# Altium schematic sheet SoftCore_SA_P2_PG7.SchDoc: =ProjectTitle
size B; Engineer: Hab S Collector; Address1: 3621 Gin Way; Address2: Snellville GA, 30039; SheetNumber: 7; SheetTotal: 7
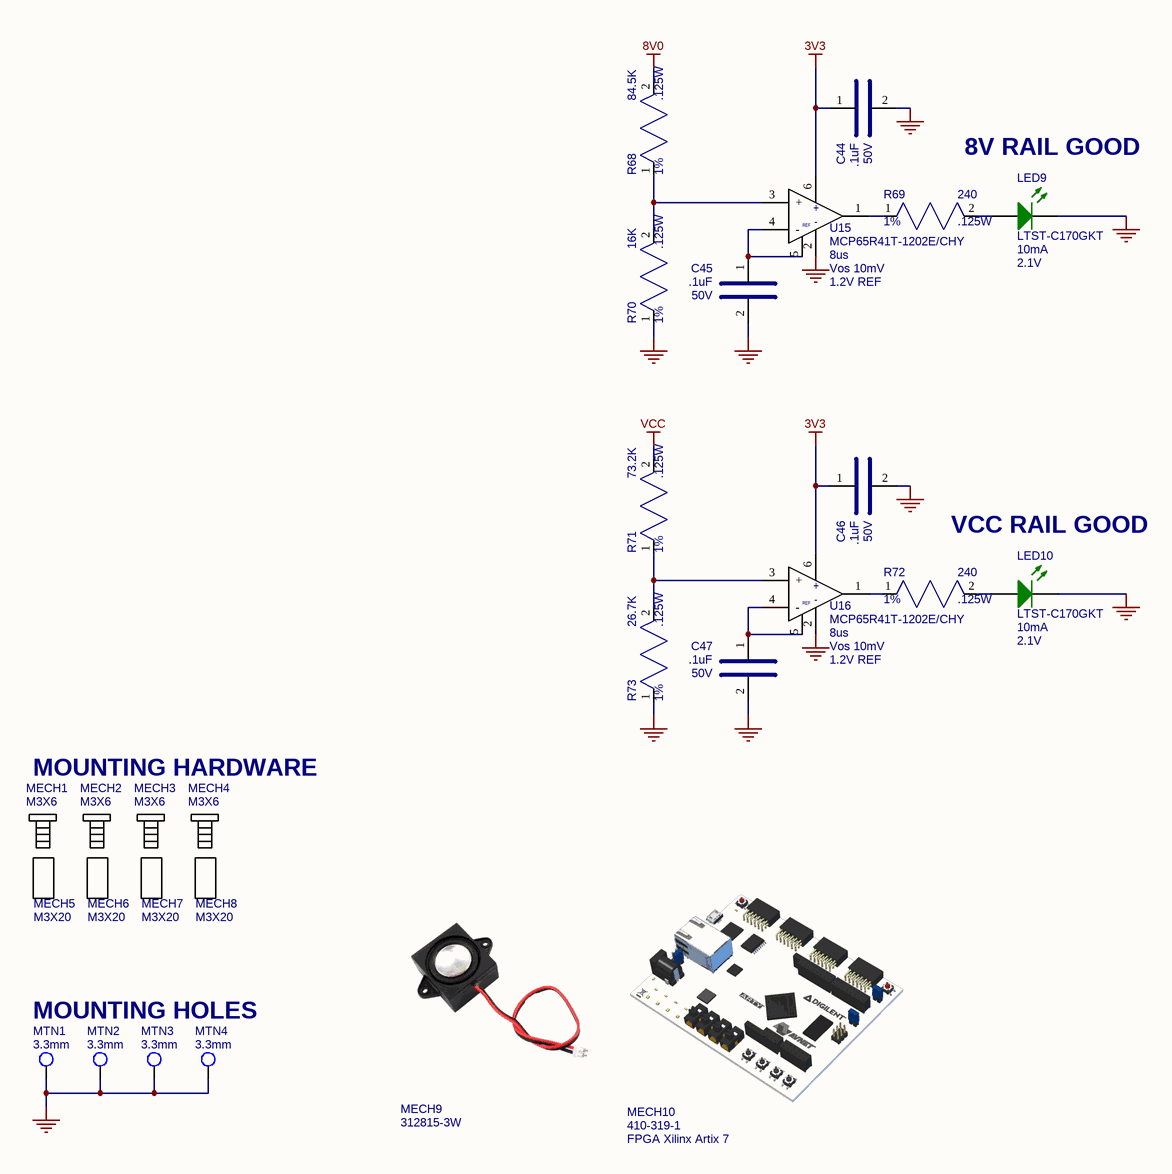
[diagram p0: SoftCore_SA_P2_PG7.SchDoc]

## Parts
C44  value .1uF  Voltage: 50V  [CAP_0805]  (hidden comment: KGM21NR71H104KT)
C45  value .1uF  Voltage: 50V  [CAP_0805]  (hidden comment: KGM21NR71H104KT)
C46  value .1uF  Voltage: 50V  [CAP_0805]  (hidden comment: KGM21NR71H104KT)
C47  value .1uF  Voltage: 50V  [CAP_0805]  (hidden comment: KGM21NR71H104KT)
LED9  value 2.1V  Current: 10mA  [LED_0805]  (hidden comment: LTST-C170GKT)
LED10  value 2.1V  Current: 10mA  [LED_0805]  (hidden comment: LTST-C170GKT)
MECH1  Size: M3X6  [MECHANICAL_SCREW_M3X6]  (hidden comment: RM3X6MM 2701)
MECH2  Size: M3X6  [MECHANICAL_SCREW_M3X6]  (hidden comment: RM3X6MM 2701)
MECH3  Size: M3X6  [MECHANICAL_SCREW_M3X6]  (hidden comment: RM3X6MM 2701)
MECH4  Size: M3X6  [MECHANICAL_SCREW_M3X6]  (hidden comment: RM3X6MM 2701)
MECH5  Size: M3X20  [MECHANICAL_SPACER_F_F_M3X20]  (hidden comment: 24407)
MECH6  Size: M3X20  [MECHANICAL_SPACER_F_F_M3X20]  (hidden comment: 24407)
MECH7  Size: M3X20  [MECHANICAL_SPACER_F_F_M3X20]  (hidden comment: 24407)
MECH8  Size: M3X20  [MECHANICAL_SPACER_F_F_M3X20]  (hidden comment: 24407)
MECH9  312815-3W  [312815-3W_PCB]
MECH10  value FPGA Xilinx Artix 7  [ARTY_A7_DEV_BOARD]  (hidden comment: 410-319-1)
MTN1  Hole Size: 3.3mm  [PMG_MT_HOLE_3.3MM]  (no BOM)
MTN2  Hole Size: 3.3mm  [PMG_MT_HOLE_3.3MM]  (no BOM)
MTN3  Hole Size: 3.3mm  [PMG_MT_HOLE_3.3MM]  (no BOM)
MTN4  Hole Size: 3.3mm  [PMG_MT_HOLE_3.3MM]  (no BOM)
R68  value 84.5K  Power: .125W  Tolerance: 1%  [RES_0805]  (hidden comment: RC0805FR-0784K5L)
R69  value 240  Power: .125W  Tolerance: 1%  [RES_0805]  (hidden comment: RC0805FR-13240RL)
R70  value 16K  Power: .125W  Tolerance: 1%  [RES_0805]  (hidden comment: RC0805FR-0716KL)
R71  value 73.2K  Power: .125W  Tolerance: 1%  [RES_0805]  (hidden comment: RC0805FR-0773K2L)
R72  value 240  Power: .125W  Tolerance: 1%  [RES_0805]  (hidden comment: RC0805FR-13240RL)
R73  value 26.7K  Power: .125W  Tolerance: 1%  [RES_0805]  (hidden comment: RC0805FR-0726K7L)
U15  Voltage Reference: 1.2V REF  Propagation Delay: 8us  Vos: Vos 10mV  [SOT-23-6_MC_MCH]  (hidden comment: MCP65R41T-1202E/CHY)
U16  Voltage Reference: 1.2V REF  Propagation Delay: 8us  Vos: Vos 10mV  [SOT-23-6_MC_MCH]  (hidden comment: MCP65R41T-1202E/CHY)

## Nets
3V3: C44.1 C46.1 U15.6 U16.6
8V0: R68.2
GND: C44.2 C45.2 C46.2 C47.2 LED9.K LED10.K MTN1.1 MTN2.1 MTN3.1 MTN4.1 R70.1 R73.1 U15.2 U16.2
VCC: R71.2
NetC45_1: C45.1 U15.4(-) U15.5
NetC47_1: C47.1 U16.4(-) U16.5
NetLED9_A: LED9.A R69.2
NetLED10_A: LED10.A R72.2
NetR68_1: R68.1 R70.2 U15.3(+)
NetR69_1: R69.1 U15.1
NetR71_1: R71.1 R73.2 U16.3(+)
NetR72_1: R72.1 U16.1

## Notes on the sheet
- 8V RAIL GOOD
- VCC RAIL GOOD
- MOUNTING HARDWARE
- MOUNTING HOLES
- Title
- Size:
- Date:
- B
- Number:
- Time:
- Revision:
- Sheet
- of
- IMR Engineering
- Engineer:
- File:
- (in symbol IC_COMPARATOR_MCP65R41T-1202E/CHY) REF

## Library data of the parts
C44-C47 = CAP_SMD_0.1UF_50V_0805: CAP CER 0.1UF 50V X7R 0805; MFG: KYOCERA AVX; Case/Package: 0805; MFG_PN: KGM21NR71H104KT; Supplier 1: DigiKey; Supplier Part Number 1: 478-KGM21NR71H104KTCT-ND; Unit Price: .1
LED9 LED10 = LED_GREEN_LTST-C170GKT: LED GREEN CLEAR SMD; MFG: Lite-On; Case/Package: 0805; Supplier 1: DigiKey; Supplier Part Number 1: 160-1179-1-ND; Unit Price: .10; MFG_PN: LTST-C170GKT
MECH1-MECH4 = MECHANICAL_SCREW_M3X6_PAN_HEAD: SCREW M3X6 PAN HEAD SS; MFG: APM Hexseal; Case/Package: SCREW_M3X6; Supplier 1: DigiKey; Supplier Part Number 1: 335-1156-ND; Unit Price: .58; MFG_PN: RM3X6MM 2701
MECH5-MECH8 = MECHANICAL_STANDOFF_M3X20: HEX STANDOFF M3 BRASS 20MM; MFG: Keystone Electronics; Case/Package: STANDOFF_M3X20; Supplier 1: DigiKey; Supplier Part Number 1: 36-24407-ND; Unit Price: 1.36; MFG_PN: 24407
MECH9 = MECHANICAL_SPEAKER_MOUNTED: SPEAKER PANEL MOUNT; MFG: ARDUINO; Case/Package: 312815-3W_PCB; Supplier 1: ARDUINO; Supplier Part Number 1: 312815-3W; Unit Price: 2.50; MFG_PN: 312815-3W
MECH10 = MODULE_ARTY_A7: DEVELOPMENT BOARD FPGA XILINX A7; MFG: Digilent, Inc.; Case/Package: NA; Supplier 1: DigiKey; Supplier Part Number 1: 1286-1206-ND; Unit Price: 299.00; MFG_PN: 410-319-1
MTN1-MTN4 = MTN_HOLE_3.3MM: MOUNTING HOLE 3.3MM
R68 = RES_SMD_84.5K_0805_1/8W_1%: RES SMD 84.5K OHM 1% 1/8W 0805; MFG: Yageo; Case/Package: 0805; MFG_PN: RC0805FR-0784K5L; Supplier 1: DigiKey; Supplier Part Number 1: 311-84.5KCRCT-ND; Unit Price: .1
R69 R72 = RES_SMD_240_0805_1/8W_1%: RES SMD 240 OHM 1% 1/8W 0805; MFG: Yageo; Case/Package: 0805; MFG_PN: RC0805FR-13240RL; Supplier 1: DigiKey; Supplier Part Number 1: 13-RC0805FR-13240RLCT-ND; Unit Price: .1
R70 = RES_SMD_16K_0805_1/8W_1%: RES SMD 16K OHM 1% 1/8W 0805; MFG: Yageo; Case/Package: 0805; MFG_PN: RC0805FR-0716KL; Supplier 1: DigiKey; Supplier Part Number 1: 311-16.0KCRCT-ND; Unit Price: .1
R71 = RES_SMD_73.2K_0805_1/8W_1%: RES SMD 73.2K OHM 1% 1/8W 0805; MFG: Yageo; Case/Package: 0805; MFG_PN: RC0805FR-0773K2L; Supplier 1: DigiKey; Supplier Part Number 1: 311-73.2KCRCT-ND; Unit Price: .1
R73 = RES_SMD_26.7K_0805_1/8W_1%: RES SMD 26.7K OHM 1% 1/8W 0805; MFG: Yageo; Case/Package: 0805; MFG_PN: RC0805FR-0726K7L; Supplier 1: DigiKey; Supplier Part Number 1: 311-26.7KCRCT-ND; Unit Price: .1
U15 U16 = IC_COMPARATOR_MCP65R41T-1202E/CHY: IC COMPARATOR 1 W/VOLT REF SOT23; MFG: Microchip Technology; Unit Price: .53; Package/Case: SOT-23-6; Supplier 1: DigiKey; Supplier Part Number 1: MCP65R41T-1202E/CHYCT-ND; MFG_PN: MCP65R41T-1202E/CHY